# EAGLE design MRF49XA (EAGLE 6.6.0)
DATABASE: ../../partsDB.txt
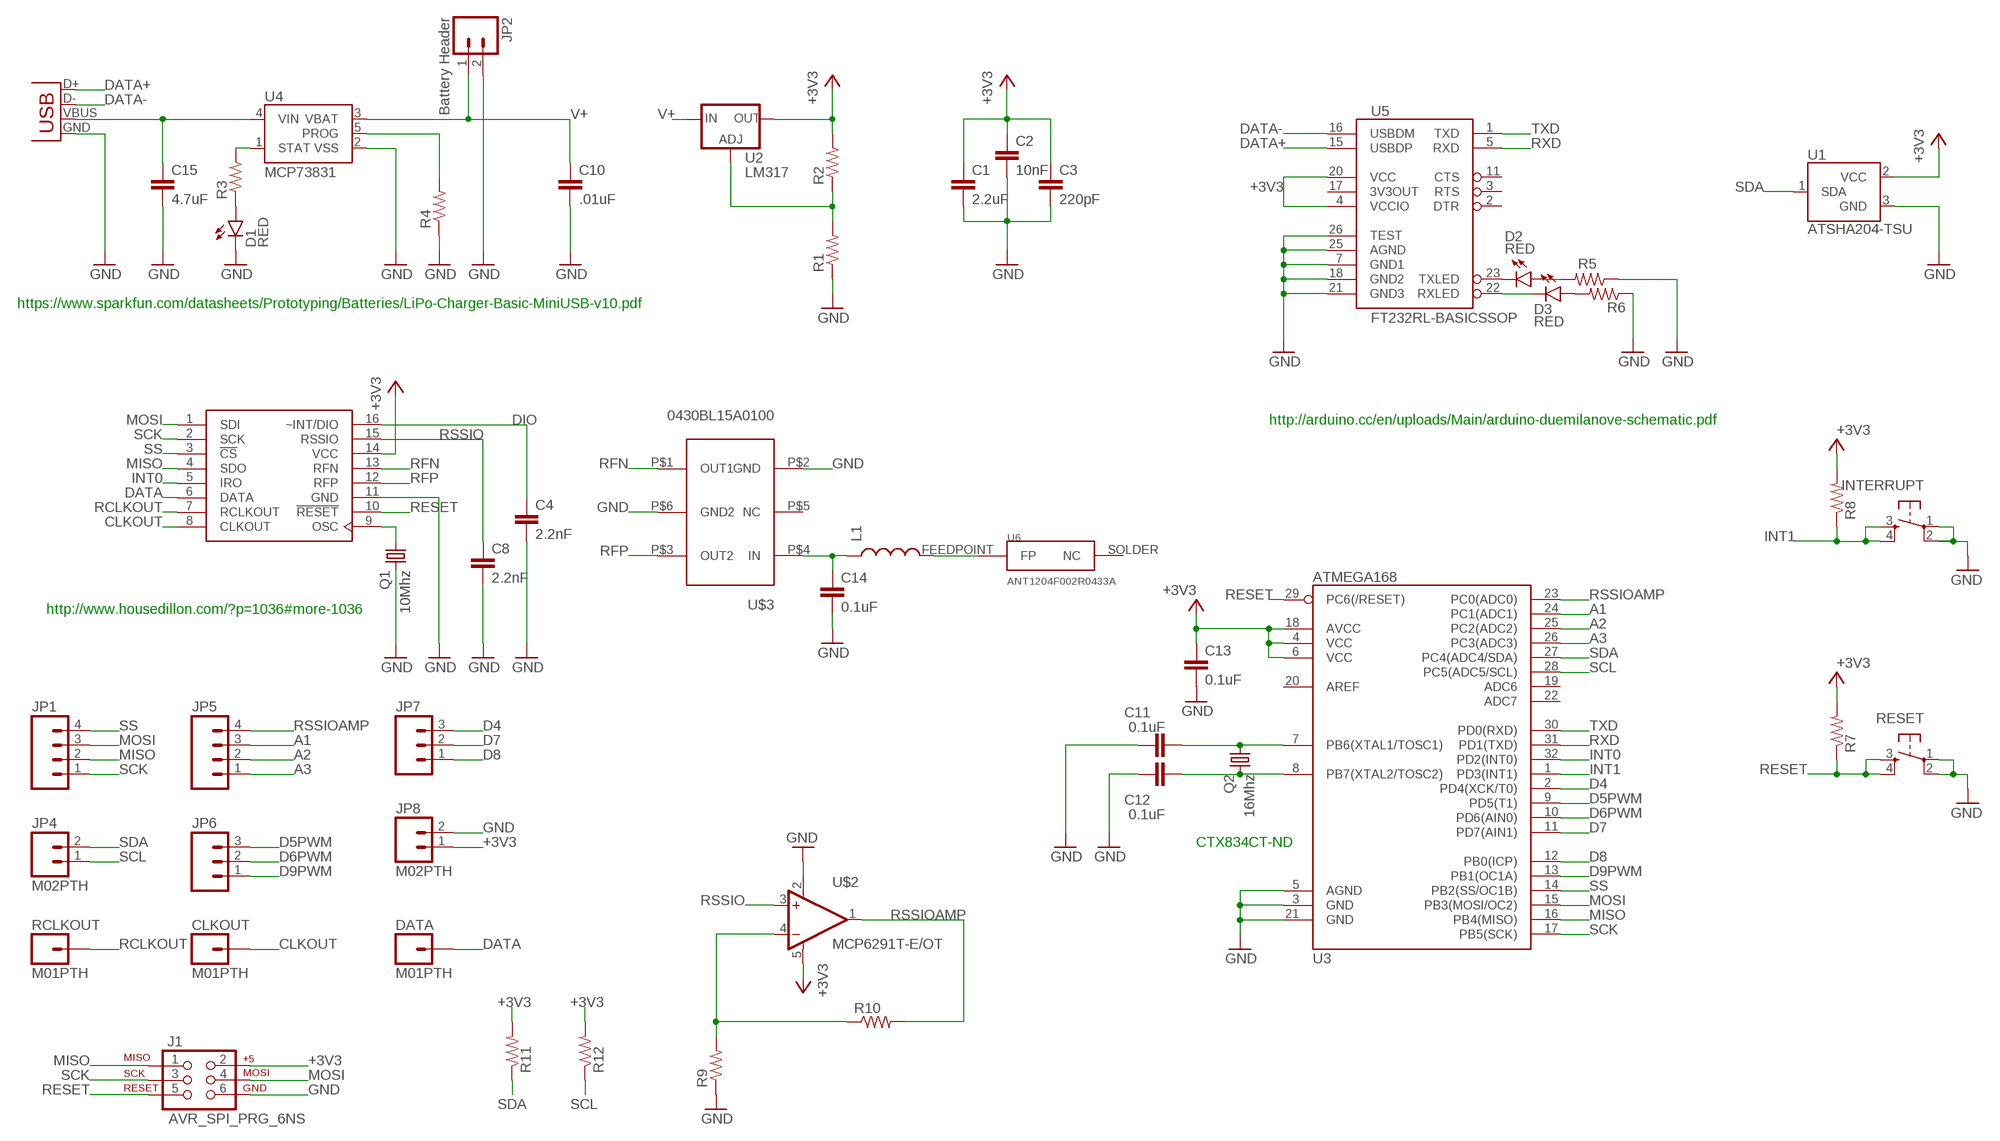
[diagram p0: schematic, sheet 1]

## Parts
C1  2.2uF  C-EUC3216  [C3216]
C2  10nF  C-EUC0603K  [C0603K]
C3  220pF  C-EUC0603  [C0603]
C4  2.2nF  C-EUC0603K  [C0603K]
C8  2.2nF  C-EUC0603K  [C0603K]
C10  .01uF  C-EUC3216  [C3216]
C11  0.1uF  0.1UF-25V-5%(0603)  [0603-CAP]
C12  0.1uF  0.1UF-25V-5%(0603)  [0603-CAP]
C13  0.1uF  0.1UF-25V-5%(0603)  [0603-CAP]
C14  0.1uF  0.1UF-25V-5%(0603)  [0603-CAP]
C15  4.7uF  C-EUC3216  [C3216]
CLKOUT  M01PTH  [1X01]
D1  RED  LED-RED0603  [LED-0603]
D2  RED  LED-RED0603  [LED-0603]
D3  RED  LED-RED0603  [LED-0603]
DATA  M01PTH  [1X01]
INTERRUPT  TAC_SWITCHSMD  [TACTILE-SWITCH-SMD]
J1  AVR_SPI_PRG_6NS  [2X3-NS]
JP1  M04PTH  [1X04]
JP2  Battery Header  M02LOCK_LONGPADS  [1X02_LOCK_LONGPADS]
JP3  USBSMD  [USB-MINIB]
JP4  M02PTH  [1X02]
JP5  M04PTH  [1X04]
JP6  M03PTH  [1X03]
JP7  M03PTH  [1X03]
JP8  M02PTH  [1X02]
L1  INDUCTOR0603  [0603]
Q1  10Mhz  CRYSTALCTS406  [CTS406]
Q2  16Mhz  CRYSTALCTS406  [CTS406]
R1  R-US_R0603  [R0603]
R2  R-US_R0603  [R0603]
R3  RESISTOR0603-RES  [0603-RES]
R4  RESISTOR0603-RES  [0603-RES]
R5  R-US_R0603  [R0603]
R6  R-US_R0603  [R0603]
R7  R-US_R0603  [R0603]
R8  R-US_R0603  [R0603]
R9  RESISTOR0603-RES  [0603-RES]
R10  RESISTOR0603-RES  [0603-RES]
R11  R-US_R0603  [R0603]
R12  R-US_R0603  [R0603]
RCLKOUT  M01PTH  [1X01]
RESET  TAC_SWITCHSMD  [TACTILE-SWITCH-SMD]
U1  ATSHA204-TSU  [SOT23-3]
U2  LM317  V_REG_317SMD  [SOT223]
U3  ATMEGA168  [TQFP32-08]
U4  MCP73831  [SOT23-5]
U5  FT232RL-BASICSSOP  [SSOP28DB]
U6  ANT1204F002R0433A  [ANT1204F002R0433A]
U$1  MRF49XA  [TSSOP16]
U$2  MCP6291T-E/OT  [SOT23-5]
U$3  0430BL15A0100  [0430BL15A0100]

## Nets
+3V3: C1.1 C2.1 C3.1 C13.1 J1.2 JP8.1 R2.2 R7.2 R8.2 R11.2 R12.2 U1.2(VCC) U2.2(OUT) U3.4(VCC) U3.6(VCC) U3.18(AVCC) U5.4(VCCIO) U5.20(VCC) U$1.14(VCC) U$2.5(V+)
A1: JP5.3 U3.24(PC1(ADC1))
A2: JP5.2 U3.25(PC2(ADC2))
A3: JP5.1 U3.26(PC3(ADC3))
CLKOUT: CLKOUT.1 U$1.8(CLKOUT)
D4: JP7.3 U3.2(PD4(XCK/T0))
D5PWM: JP6.3 U3.9(PD5(T1))
D6PWM: JP6.2 U3.10(PD6(AIN0))
D7: JP7.2 U3.11(PD7(AIN1))
D8: JP7.1 U3.12(PB0(ICP))
D9PWM: JP6.1 U3.13(PB1(OC1A))
DATA: DATA.1 U$1.6(DATA)
DATA+: JP3.D+ U5.15(USBDP)
DATA-: JP3.D- U5.16(USBDM)
DIO: C4.1 U$1.16(~INT/DIO)
GND: C1.2 C2.2 C3.2 C4.2 C8.2 C10.2 C11.1 C12.1 C13.2 C14.2 C15.2 D1.C INTERRUPT.1 INTERRUPT.2 J1.6 JP2.2 JP3.GND JP8.2 Q1.3 R1.1 R4.1 R5.1 R6.1 R9.1 RESET.1 RESET.2 U1.3(GND) U3.3(GND) U3.5(AGND) U3.21(GND) U4.2(VSS) U5.7(GND1) U5.18(GND2) U5.21(GND3) U5.25(AGND) U5.26(TEST) U$1.11(GND) U$2.2(V-) U$3.P$2(GND) U$3.P$6(GND2)
INT0: U3.32(PD2(INT0)) U$1.5(IRO)
INT1: INTERRUPT.3 INTERRUPT.4 R8.1 U3.1(PD3(INT1))
MISO: J1.1 JP1.2 U3.16(PB4(MISO)) U$1.4(SDO)
MOSI: J1.4 JP1.3 U3.15(PB3(MOSI/OC2)) U$1.1(SDI)
N$1: Q1.1 U$1.9(OSC)
N$2: L1.2 U6.FEEDPOINT(FP)
N$3: C15.1 JP3.VBUS U4.4(VIN)
N$5: R3.2 U4.1(STAT)
N$6: D1.A R3.1
N$8: R4.2 U4.5(PROG)
N$9: D2.C U5.23(TXLED)
N$10: D3.C U5.22(RXLED)
N$11: D2.A R5.2
N$12: D3.A R6.2
N$13: C11.2 Q2.1 U3.7(PB6(XTAL1/TOSC1))
N$14: C12.2 Q2.3 U3.8(PB7(XTAL2/TOSC2))
N$16: R9.2 R10.1 U$2.4(-IN)
N$19: R1.2 R2.1 U2.1(ADJ)
N$21: C14.1 L1.1 U$3.P$4(IN)
RCLKOUT: RCLKOUT.1 U$1.7(RCLKOUT)
RESET: J1.5 R7.1 RESET.3 RESET.4 U3.29(PC6(/RESET)) U$1.10(!RESET)
RFN: U$1.13(RFN) U$3.P$1(OUT1)
RFP: U$1.12(RFP) U$3.P$3(OUT2)
RSSIO: C8.1 U$1.15(RSSIO) U$2.3(+IN)
RSSIOAMP: JP5.4 R10.2 U3.23(PC0(ADC0)) U$2.1(OUT)
RXD: U3.31(PD1(TXD)) U5.5(RXD)
SCK: J1.3 JP1.1 U3.17(PB5(SCK)) U$1.2(SCK)
SCL: JP4.1 R12.1 U3.28(PC5(ADC5/SCL))
SDA: JP4.2 R11.1 U1.1(SDA) U3.27(PC4(ADC4/SDA))
SS: JP1.4 U3.14(PB2(SS/OC1B)) U$1.3(!CS)
TXD: U3.30(PD0(RXD)) U5.1(TXD)
V+: C10.1 JP2.1 U2.3(IN) U4.3(VBAT)
Unconnected: U3.19(ADC6) U3.20(AREF) U3.22(ADC7) U5.2(DTR) U5.3(RTS) U5.11(CTS) U5.17(3V3OUT) U6.SOLDER(NC) U$3.P$5(NC)

## Notes on the sheet
- https://www.sparkfun.com/datasheets/Prototyping/Batteries/LiPo-Charger-Basic-MiniUSB-v10.pdf
- http://arduino.cc/en/uploads/Main/arduino-duemilanove-schematic.pdf
- http://www.housedillon.com/?p=1036#more-1036
- CTX834CT-ND

## Power pins joined to a net without a drawn wire
VSS: U$1.P$1(VSS)

## Library data of the parts
C1-C4 C8 C10 C15 = rcl:C-EU: CAPACITOR, European symbol
C11-C14 = SparkFun-Capacitors:0.1UF-25V-5%(0603): CAP-08604; PROD_ID: CAP-08604
CLKOUT DATA RCLKOUT = SparkFun-Connectors:M01: Header 1 Standard 1-pin 0.1" header. Use with straight break away headers (SKU : PRT-00116), right angle break away headers (PRT-00553), swiss pins (PRT-00743), machine pins (PRT-00117), and female headers (PRT-00115).
D1-D3 = SparkFun-LED:LED-RED: Assorted Red LEDs LilyPad 1206- DIO-09912 1206- DIO-00809 0603- DIO-00819; PROD_ID: DIO-00819
INTERRUPT RESET = SparkFun-Electromechanical:TAC_SWITCH: Momentary Switch Button commonly used for reset or general input. Spark Fun Electronics SKU : COM-00097 SMT- SWCH-08247
J1 = SparkFun-Connectors:AVR_SPI_PRG_6: AVR ISP 6 Pin This is the reduced ISP connector for AVR programming. Common on Arduino. This footprint will take up less PCB space and can be used with a 10-pin to 6-pin adapter such as SKU: BOB-08508 **Special note about "TEST_POINT" package. The stop mask is on the top side, so if you want your programming test points to be on the bottom of your board, make sure to place this package on the bottom side of the board. This also ensure that the orientation to program from the bottom side will be correct.
JP1 JP5 = SparkFun-Connectors:M04: Header 4 Standard 4-pin 0.1" header. Use with straight break away headers (SKU : PRT-00116), right angle break away headers (PRT-00553), swiss pins (PRT-00743), machine pins (PRT-00117), and female headers (PRT-00115). Molex polarized connector foot print use with SKU : PRT-08231 with associated crimp pins and housings. 1MM SMD Version SKU: PRT-10208
JP2 JP4 JP8 = SparkFun-Connectors:M02: Standard 2-pin 0.1" header. Use with - straight break away headers ( PRT-00116) - right angle break away headers (PRT-00553) - swiss pins (PRT-00743) - machine pins (PRT-00117) - female headers (PRT-00115) Molex polarized connector foot print use with: PRT-08233 with associated crimp pins and housings. 2.54_SCREWTERM for use with PRT-10571. 3.5mm Screw Terminal footprints for PRT-08084 5mm Screw Terminal footprints for use with PRT-08433
JP3 = SparkFun-Connectors:USB: USB Connectors USB-B-PTH is fully proven SKU : PRT-00139/CONN-08278 USB-miniB is fully proven SKU : PRT-00587 USB-A-PCB is untested. USB-A-H is throughly reviewed, but untested. Spark Fun Electronics SKU : PRT-00437 USB-B-SMT is throughly reviewed, but untested. Needs silkscreen touching up. USB-A-S has not been used/tested USB-MB-H has not been used/tested USB-MICROB has been used. CONN-09505; PROD_ID: CONN-08193
JP6 JP7 = SparkFun-Connectors:M03: Header 3 Standard 3-pin 0.1" header. Use with straight break away headers (SKU : PRT-00116), right angle break away headers (PRT-00553), swiss pins (PRT-00743), machine pins (PRT-00117), and female headers (PRT-00115). Molex polarized connector foot print use with SKU : PRT-08232 with associated crimp pins and housings.
L1 = SparkFun-Passives:INDUCTOR: Inductors Basic Inductor/Choke - 0603 and 1206. Footprints are not proven and vary greatly between part numbers. SRN6045- 33uH, 20% 1.4A SDR0403-560KL - 56uH, 10%, 500mA RMS/740mA peak
Q1 Q2 = crystal:CRYSTAL: CRYSTAL; OC_FARNELL: unknown; OC_NEWARK: unknown
R1 R2 R5-R8 R11 R12 = rcl:R-US_: RESISTOR, American symbol
R3 R4 R9 R10 = SparkFun-Passives:RESISTOR: Resistor Basic schematic elements and footprints for 0603, 1206, and PTH resistors.
U1 = SparkFun-DigitalIC:ATSHA204: Atmel ATSHA204 The Atmel ATSHA204 is an optimized authentication chip that includes a 4.5Kb EEPROM. This array can be used for storage of keys, miscellaneous read/write, read-only, password or secret data, and consumption tracking. Access to the various sections of memory can be restricted in a variety of ways and then the configuration locked to prevent changes.
U2 = SparkFun:V_REG_317: Voltage Regulator Standard LM317 adjustable voltage regulator. AOI (Adjust Output Input). Google 'LM317 Calculator' for easy to use app to get the two resistor values needed. 240/720 for 5V output. 240/390 for 3.3V output. Spark Fun Electronics SKU : COM-00527
U3 = SparkFun-DigitalIC:ATMEGA168: Atmel 32-pin 8-bit micro, 16k flash.
U4 = SparkFun-PowerIC:MCP73831: Miniature single cell, fully integrated Li-Ion, Li-polymer charge management controller http://ww1.microchip.com/downloads/en/DeviceDoc/21984a.pdf IC-09995; PROD_ID: IC-09995
U5 = SparkFun-DigitalIC:FT232RL-BASIC: USB UART This is the simplified version of the FT232RL unit. Only what you need, nothing you don't. Spark Fun Electronics SKU : COM-00650
U6 = TestLibrary:ANT1204F002R0433A: ANT1204F002R0433A http://www.yageo.com/documents/recent/An_SMD_UHF_433_1204_0.pdf
U$1 = microchip:MRF49XA
U$2 = SparkFun-AnalogIC:MCP6291: Rail to rail OpAmp with 10MHz GBP; PROD_ID: IC-11991
U$3 = TestLibrary:0430BL15A0100: 430Mhz Balun from Johanson Technologies

## Board
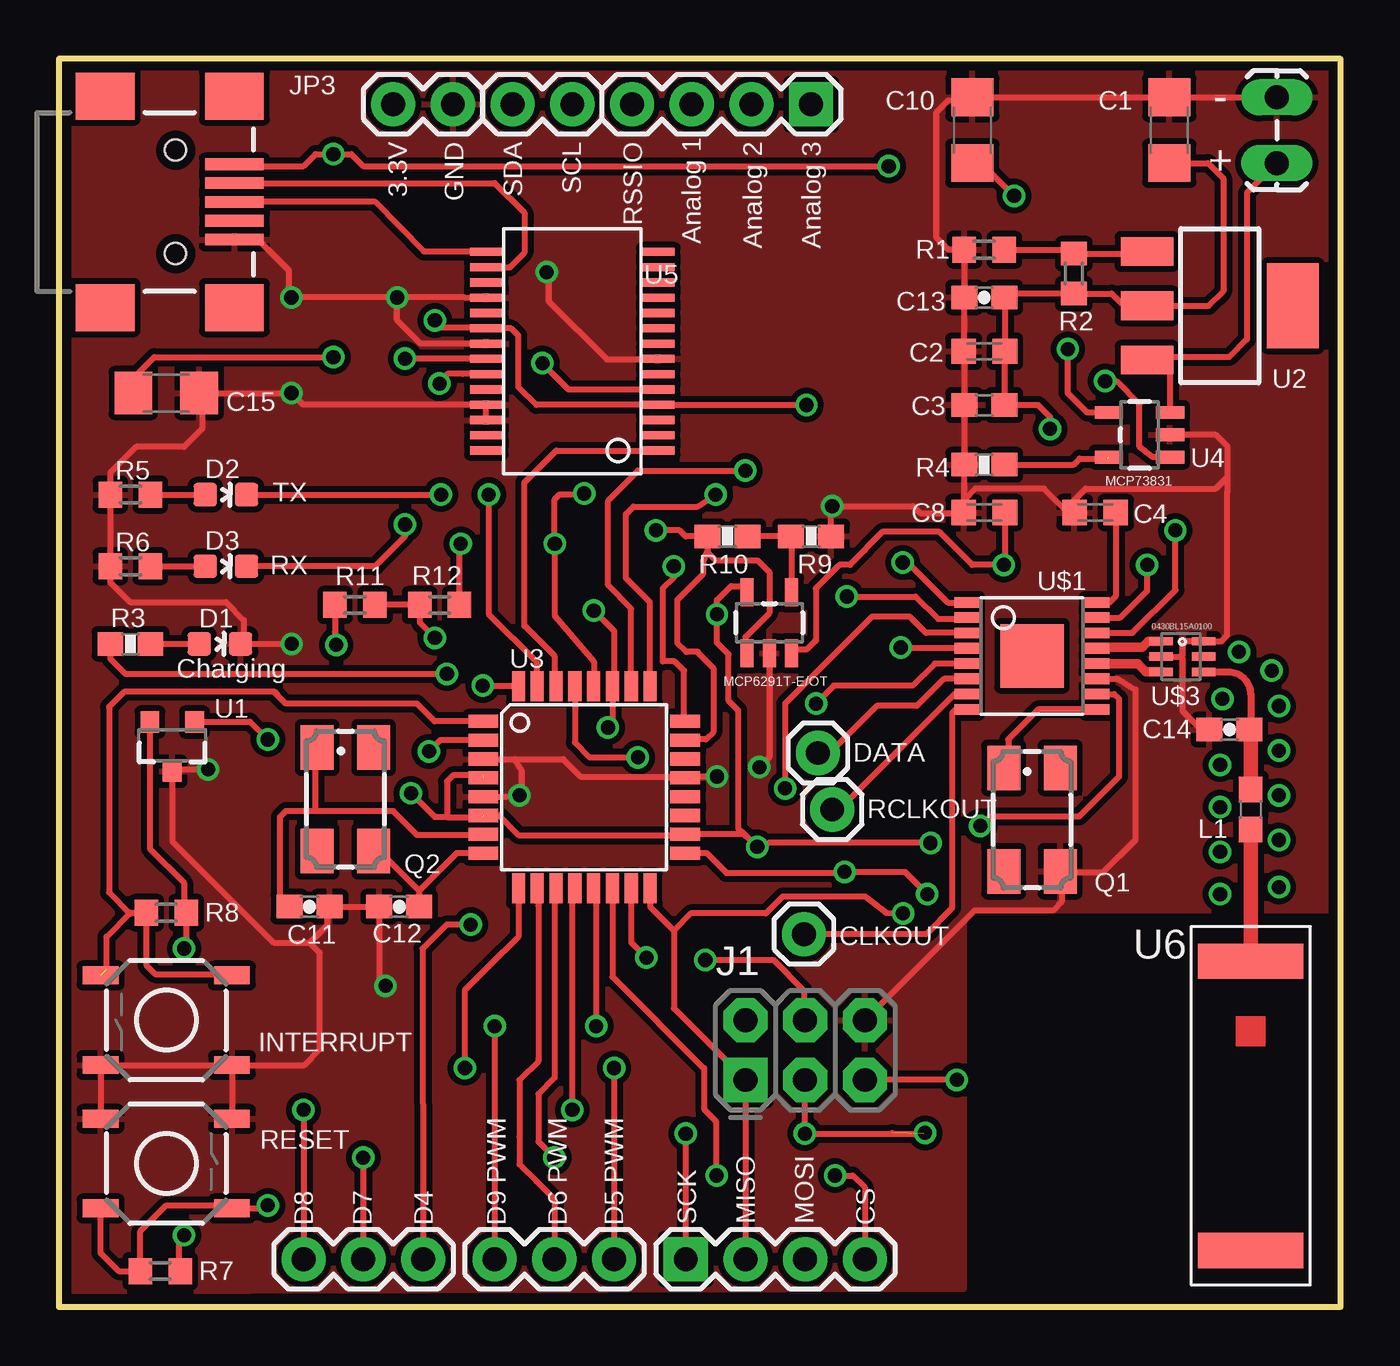
[diagram p1: board, top side]
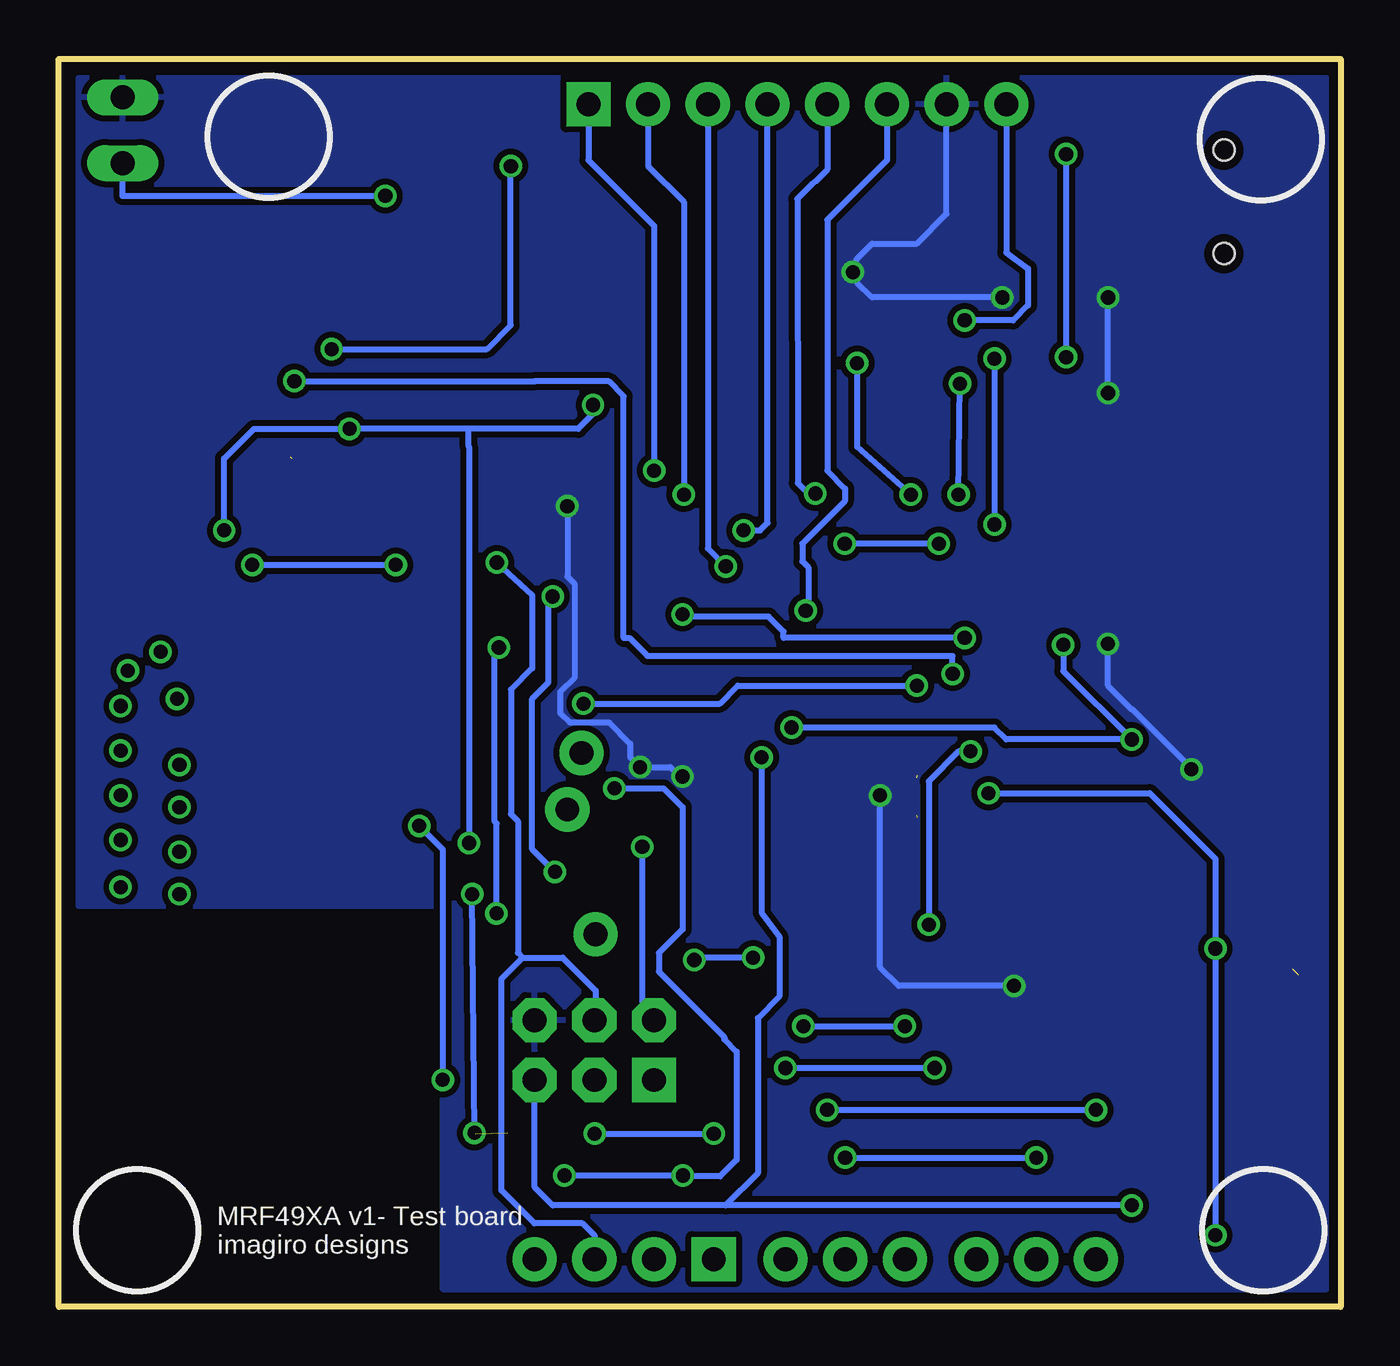
[diagram p2: board, bottom side, seen from below]

Size 54.53 x 53.08 mm. Coordinates in mm from the lower left corner, seen from the top.
Outline: 0,0 54.53,0 54.53,53.08 0,53.08 0,0
Copper layers (1*16): Top 0.0356mm / dielectric 1.5011mm / Bottom 0.0356mm
Design rules "LaenPCBOrder": minimum track width 6mil, minimum drill 13mil, track to track 6mil, track to pad 6mil, pad to pad 6mil, via to via 6mil, smd to smd 6mil, copper to edge 15mil, drill to drill 6mil, minimum pad ring 7mil, minimum via ring 7mil, stop-mask expansion 3mil, vias tented up to drill 0mil, thermal gap 10mil

### Footprints (pad centres in the part's own frame; a part is rotated, then mirrored left to right if it is on the bottom)
C3216 = smd 1.6 x 1.8: 1 -1.4,0; 2 1.4,0
C0603K = smd 1.05 x 1.08: 1 -0.875,0; 2 0.875,0
C0603 = smd 1.1 x 1: 1 -0.85,0; 2 0.85,0
0603-CAP = smd 1.1 x 1: 1 -0.85,0; 2 0.85,0
1X01 = drill 1.016 pad 1.88: 1 0,0
LED-0603 = smd 1 x 1: A 0,-0.877; C 0,0.877
TACTILE-SWITCH-SMD = smd 1.524 x 0.762: 1 -2.794,1.905; 2 2.794,1.905; 3 -2.794,-1.905; 4 2.794,-1.905
2X3-NS = drill 1.016 pad 1.88 square: 1 -2.54,-1.27 | drill 1.016 pad 1.88 octagon: 2 -2.54,1.27; 3 0,-1.27; 4 0,1.27; 5 2.54,-1.27; 6 2.54,1.27
1X04 = drill 1.016 pad 1.88 square: 1 0,0 | drill 1.016 pad 1.88: 2 2.54,0; 3 5.08,0; 4 7.62,0
1X02_LOCK_LONGPADS = drill 1.016 long: 1 -0.127,0; 2 2.667,0
USB-MINIB = smd 2.5 x 0.5: D+ 2.5,0; D- 2.5,0.8; GND 2.5,-1.6; ID 2.5,-0.8; VBUS 2.5,1.6 | smd 2.5 x 2: MTN1 -3,4.5; MTN2 2.5,4.5; MTN3 -3,-4.5; MTN4 2.5,-4.5 | hole 0.9: 0,2.2; 0,-2.2
1X02 = drill 1.016 pad 1.88: 1 0,0; 2 2.54,0
1X03 = drill 1.016 pad 1.88: 1 0,0; 2 2.54,0; 3 5.08,0
0603 = smd 1.1 x 1: 1 -0.85,0; 2 0.85,0
CTS406 = smd 1.9 x 1.4: 1 -2.2,-1.2; 2 2.2,-1.2; 3 2.2,1.2; 4 -2.2,1.2
R0603 = smd 1 x 1.1: 1 -0.85,0; 2 0.85,0
0603-RES = smd 1.1 x 1: 1 -0.85,0; 2 0.85,0
SOT23-3 = smd 0.8 x 0.9: 1 -0.95,-1; 2 0.95,-1; 3 0,1.1
SOT223 = smd 1.219 x 2.235: 1 -2.311,-3.099; 2 0,-3.099; 3 2.311,-3.099 | smd 3.6 x 2.2: 4 0,3.099
TQFP32-08 = smd 1.27 x 0.559: 1 -4.293,2.8; 2 -4.293,2; 3 -4.293,1.2; 4 -4.293,0.4; 5 -4.293,-0.4; 6 -4.293,-1.2; 7 -4.293,-2; 8 -4.293,-2.8; 17 4.293,-2.8; 18 4.293,-2; 19 4.293,-1.2; 20 4.293,-0.4; 21 4.293,0.4; 22 4.293,1.2; 23 4.293,2; 24 4.293,2.8 | smd 0.559 x 1.27: 9 -2.8,-4.293; 10 -2,-4.293; 11 -1.2,-4.293; 12 -0.4,-4.293; 13 0.4,-4.293; 14 1.2,-4.293; 15 2,-4.293; 16 2.8,-4.293; 25 2.8,4.293; 26 2,4.293; 27 1.2,4.293; 28 0.4,4.293; 29 -0.4,4.293; 30 -1.2,4.293; 31 -2,4.293; 32 -2.8,4.293
SOT23-5 = smd 0.55 x 1.2: 1 -0.95,-1.3; 2 0,-1.3; 3 0.95,-1.3; 4 0.95,1.3; 5 -0.95,1.3
SSOP28DB = smd 0.348 x 1.397: 1 -4.225,-3.656; 2 -3.575,-3.656; 3 -2.925,-3.656; 4 -2.275,-3.656; 5 -1.625,-3.656; 6 -0.975,-3.656; 7 -0.325,-3.656; 8 0.325,-3.656; 9 0.975,-3.656; 10 1.625,-3.656; 11 2.275,-3.656; 12 2.925,-3.656; 13 3.575,-3.656; 14 4.225,-3.656; 15 4.225,3.656; 16 3.575,3.656; 17 2.925,3.656; 18 2.275,3.656; 19 1.625,3.656; 20 0.975,3.656; 21 0.325,3.656; 22 -0.325,3.656; 23 -0.975,3.656; 24 -1.625,3.656; 25 -2.275,3.656; 26 -2.925,3.656; 27 -3.575,3.656; 28 -4.225,3.656
ANT1204F002R0433A = smd 1.5 x 4.5: FEEDPOINT -6.15,0; SOLDER 6.15,0
TSSOP16 = smd 0.45 x 1.05: 1 -2.275,-2.768; 2 -1.625,-2.768; 3 -0.975,-2.768; 4 -0.325,-2.768; 5 0.325,-2.768; 6 0.975,-2.768; 7 1.625,-2.768; 8 2.275,-2.768; 9 2.275,2.768; 10 1.625,2.768; 11 0.975,2.768; 12 0.325,2.768; 13 -0.325,2.768; 14 -0.975,2.768; 15 -1.625,2.768; 16 -2.275,2.768 | smd 2.7 x 2.7: P$1 0,0
0430BL15A0100 = smd 0.35 x 1: P$1 0.65,0.9; P$2 0,0.9; P$3 -0.65,0.9; P$4 -0.65,-0.9; P$5 0,-0.9; P$6 0.65,-0.9

### Placement (x,y rotation side)
C1  47.24,50.04 90 top
C2  39.37,40.64 180 top
C3  39.37,38.35 180 top
C4  44.09,33.78 180 top
C8  39.37,33.78 180 top
C10  38.86,50.04 90 top
C11  10.67,17.02 180 top
C12  14.48,17.02 0 top
C13  39.37,42.93 180 top
C14  49.8,24.55 180 top
C15  4.57,38.86 0 top
CLKOUT  31.7,15.85 0 top
D1  6.86,28.19 270 top
D2  7.11,34.54 270 top
D3  7.11,31.5 270 top
DATA  32.3,23.55 0 top
INTERRUPT  4.57,12.19 180 top
J1  31.75,10.92 0 top
JP1  26.67,2.03 0 top
JP2  51.82,48.77 90 top
JP3  4.97,46.99 0 top
JP4  21.84,51.15 180 top
JP5  32,51.15 180 top
JP6  18.54,2.03 0 top
JP7  10.41,2.03 0 top
JP8  14.22,51.15 0 top
L1  50.7,21.15 270 top
Q1  41.4,20.72 270 top
Q2  12.19,21.59 270 top
R1  39.37,44.96 0 top
R2  43.18,43.94 270 top
R3  3.05,28.19 180 top
R4  39.37,35.81 0 top
R5  3.05,34.54 0 top
R6  3.05,31.5 0 top
R7  4.32,1.52 0 top
R8  4.57,16.76 0 top
R9  32,32.77 180 top
R10  28.45,32.77 180 top
R11  12.6,29.85 0 top
R12  16.2,29.85 180 top
RCLKOUT  32.9,21.15 0 top
RESET  4.57,6.1 0 top
U1  4.83,23.88 180 top
U2  49.39,42.57 270 top
U3  22.35,22.1 0 top
U4  45.97,37.08 90 top
U5  21.84,40.64 90 top
U6  50.7,8.55 270 top
U$1  41.4,27.69 270 top
U$2  30.23,29.09 0 top
U$3  47.8,27.65 90 top

### Tracks (layer width: path | path; a pad name or v marks a point on that pad's centre or on a via)
+3V3  (via drill 0.6)  (2 unrouted)
  Top 0.254: C1.1 48.9,48.64 49.53,48.01 49.53,43.18 48.92,42.57 U2.2 45.21,42.67 44.79,43.09 R2.2 40.39,43.09 C13.1 40.24,42.9 C2.1 40.24,38.38 C3.1 41.66,38.35 42.16,37.85 v42.16,37.34 | v31.81,38.35 25.65,38.35 U5.4 25.4,38.35 20.32,38.35 19.56,39.12 19.56,41.3 19.24,41.62 18.23,41.62 U5.20 18.15,41.65 16.3,41.65 v16,41.95 | 16.51,20.83 16.51,22.35 16.76,22.61 18.03,22.61 | 16.51,20.83 18.03,20.83 | U1.2 3.88,19.49 5.33,18.03 5.33,16.85 R8.2 5.42,15.07 v5.33,15.24 | 29.18,20.1 v29.71,19.57 | v5.33,3.05 5.1,2.75 5.1,1.96 5.08,1.94 R7.2 | 16.51,20.83 16,20.83 v14.99,21.84 | v37.08,19.73 30.2,19.73 30.04,19.57 v29.71,19.57 | U$1.14 45.68,28.66 47.5,30.48 v47.5,33.02 | U3.6 18.73,20.9 19.56,20.07 26.61,20.07 U3.18 29.18,20.1 | R11.2 R12.2 15.35,29.1 v16,28.45 | 29.21,20.03 v29.71,19.57 | U$2.5 29.02,30.65 28.6,30.65 28,30.05 v28,29.45 28,28.25 28.5,27.75 28.5,25.77 28.9,25.37 28.9,20.35 29.18,20.1
  Bottom 0.254: J1.2 29.7,12.95 v29.7,19.56 v29.71,19.57 | v5.33,3.05 v5.33,15.24 5.33,19.05 8.13,21.84 v14.99,21.84 | v31.81,38.35 v31.8,38.35 31.8,37.97 32.44,37.34 37.1,37.34 | 37.1,37.34 v42.16,37.34 46.23,37.34 47.5,36.07 v47.5,33.02 | v37.08,19.73 37.08,36.58 37.1,36.59 37.1,37.34 | v16,28.45 23.7,28.45 23.7,28.72 24.34,29.35 27.9,29.35 v28,29.45 | JP8.1 14.22,44.83 13.3,44.15 13.3,42.59 13.94,41.95 v16,41.95
A1  (via drill 0.6)
  Top 0.254: U3.24 26.6,24.85 26.6,27.05 26.2,27.45 25.7,27.45 25.7,30.55 26.16,31.02 v26.16,31.5
  Bottom 0.254: JP5.3 26.92,32.26 v26.16,31.5
A2  (via drill 0.6)
  Top 0.254: U3.25 25.15,29.97 24.13,30.99 24.13,33.72 24.45,34.04 27.18,34.04 v27.94,34.54
  Bottom 0.254: JP5.2 29.46,48.51 27.94,46.99 v27.94,34.54
A3  (via drill 0.6)
  Top 0.254: U3.26 24.35,29.69 24.34,29.69 23.37,30.69 23.37,34.29 24.64,35.56 v29.21,35.56
  Bottom 0.254: JP5.1 32,48.77 29.21,45.97 v29.21,35.56
CLKOUT
  Top 0.254: U$1.8 38.16,25.41 38,25.25 38,16.95 36.9,15.85 CLKOUT.1
D4  (via drill 0.6)
  Top 0.254: U3.2 16.22,24.1 v15.75,23.62 | v17.53,16.26 16.51,16.26 16.49,16.25 15.47,15.23 JP7.3
  Bottom 0.254: v15.75,23.62 16.26,23.62 17.53,22.35 v17.53,16.26
D5PWM  (via drill 0.6)
  Top 0.254: U3.9 19.56,15.75 18.29,14.48 17.78,13.97 17.27,13.46 v17.27,10.16 | v23.62,10.16 JP6.3
  Bottom 0.254: v17.27,10.16 v23.62,10.16
D6PWM
  Top 0.254: U3.10 20.32,17.77 20.4,17.05 20.4,10.55 20.4,10.45 19.6,9.65 19.6,7.25 19.6,6.05 20.32,5.33 21.08,4.57 JP6.2
D7  (via drill 0.6)
  Top 0.254: U3.11 21.08,17.74 21.1,17.05 21.1,9.75 20.4,9.05 20.4,7.03 v21.08,6.35 | v12.95,6.35 JP7.2
  Bottom 0.254: v21.08,6.35 v12.95,6.35
D8  (via drill 0.6)
  Top 0.254: U3.12 21.84,17.7 v21.84,8.38 | v10.41,8.38 JP7.1
  Bottom 0.254: v21.84,8.38 v10.41,8.38
D9PWM  (via drill 0.6)
  Top 0.254: U3.13 22.86,17.7 v22.86,11.94 | v18.54,11.94 JP6.1
  Bottom 0.254: v22.86,11.94 v18.54,11.94
DATA
  Top 0.254: U$1.6 37.66,26.71 36.5,25.55 34.8,25.55 33,23.75 33,23.55 DATA.1
DATA+
  Top 0.254: U5.15 18.09,44.88 15.54,44.88 13.46,46.99 7.11,46.99 JP3.D+
DATA-
  Top 0.254: JP3.D- 18.54,47.79 19.81,46.52 19.81,44.83 19.18,44.2 18.21,44.2 U5.16
DIO
  Top 0.254: C4.1 44.96,30.22 44.7,29.95 U$1.16
GND  (via drill 0.6)
  Top 0.254: JP2.2 53.08,51.44 C1.2 C10.2 38.73,51.31 37.85,51.31 37.34,50.8 37.34,45.47 37.85,44.96 R1.1 C13.2 38.49,42.9 C2.2 38.52,40.61 C3.2 R4.1 38.49,35.79 38.49,34.29 | 38.49,34.29 C8.2 38.47,33.75 36.65,33.75 36.35,34.05 v32.9,34.05 | JP3.GND 7.11,45.47 8.4,45.47 9.4,44.47 9.8,44.05 9.8,43.02 v9.9,42.93 v14.39,42.93 | v14.39,42.93 17.27,42.93 U5.18 | U5.26 U5.25 10.39,38.36 v9.9,38.86 C15.2 6.1,38.74 6.1,37.34 5.33,36.58 3.3,36.58 2.2,35.47 R5.1 R6.1 2.2,30.82 3.05,29.97 7.11,29.97 7.87,29.21 7.87,28.33 D1.C v9.91,28.19 | U5.21 17.2,40.96 17.04,40.97 15.39,40.97 14.39,41.97 v14.39,42.93 | v20.75,44 20.84,43.92 20.84,42.77 23.32,40.29 25.48,40.29 U5.7 | 10.67,15.49 9.14,15.49 4.83,19.81 U1.3 4.91,22.86 v6.35,22.86 | 10.67,15.49 11.43,16.26 11.43,16.93 C11.1 C12.1 13.63,13.93 v13.9,13.65 | 49.72,35.31 49.21,34.8 43.69,34.8 42.81,33.92 C4.2 42.81,33.89 41.91,34.8 39,34.8 38.49,34.29 | 49.72,35.31 49.72,36.58 49.21,37.08 U4.2 | 42.6,19.27 Q1.3 42.67,18.45 | U$3.P$2 47.7,27.65 | 47.7,27.65 47.8,27.55 47.8,25.35 48.6,24.55 C14.2 | 49.72,35.31 49.72,34.68 49.7,34.65 49.7,28.55 49.45,28.3 U$3.P$6 47.95,28.3 47.8,28.15 47.8,27.75 47.7,27.65 | U$1.11 45.04,26.71 45.8,26.25 45.8,19.85 44.4,18.45 42.67,18.45 | 42.67,18.45 42.67,17.23 42.3,16.85 38.95,16.85 J1.6 | RESET.1 INTERRUPT.2 INTERRUPT.1 | INTERRUPT.1 RESET.2 | R9.1 32.8,32.82 | U$2.2 30.23,23.38 v29.8,22.95 | v28,22.55 26.7,22.55 U3.21 26.59,22.55 22.2,22.55 21.46,23.3 19.4,23.3 | R9.1 32.85,33.75 v32.9,34.05 | R9.1 32.85,33.71 v32.9,34.05 | U3.3 19.4,23.3 | U3.5 19.04,21.7 19.7,21.75 | 19.7,21.75 19.7,22.8 19.4,23.3
  Top 0.254: INTERRUPT.1 10.43,10.29 11.1,10.95 11.1,15.06 10.67,15.49 | 19.7,21.75 19.8,21.85 v19.6,21.75
  Bottom 0.254: JP8.2 16.76,46.48 18.03,45.21 19.94,45.21 20.57,44.58 v20.75,44 20.57,43.56 19.94,42.93 v14.39,42.93 | v9.9,38.86 v9.9,42.93 | v6.35,22.86 6.35,22.9 8.85,25.4 8.89,25.4 9.91,26.42 v9.91,28.19 | v28,22.55 28.2,22.55 28.2,22.64 28.52,22.95 v29.8,22.95 30.23,23.38 30.23,23.95 31.13,24.85 32.8,24.85 33.2,25.25 33.2,26.15 32.6,26.75 32.6,30.75 32.9,31.05 v32.9,34.05 | v13.9,13.65 18.8,13.65 19.6,14.45 v19.6,21.75
  pour Top (isolate 0.254): 0.8,52.55 54,52.55 54,16.85 38.5,16.85 38.5,0.75 0.6,0.65 0.6,52.65 0.9,52.65
  pour Bottom (isolate 0.254): 0.6,52.25 53.7,52.25 53.7,17.05 38.2,17.05 38.2,0.75 0.6,0.75
INT0  (via drill 0.6)
  Top 0.254: U$1.5 37.27,27.36 36.32,26.42 32.97,26.42 v32.21,25.65 | U3.32 18.06,26.39 v18.03,26.42
  Bottom 0.254: v32.21,25.65 26.42,25.65 25.65,26.42 v18.03,26.42
INT1  (1 unrouted)
  Top 0.254: 2.03,14.35 2.03,15.75 3.05,16.76 | 3.05,16.76 R8.1 3.72,14.53 4.1,14.15 7.31,14.15 INTERRUPT.3 | U3.1 16,24.9 15.24,25.65 9.65,25.65 9.14,26.16 9.35,25.96 9.2,26.15 2.77,26.15 2.14,25.52 2.14,17.63 3.05,16.72 3.05,16.76
MISO  (via drill 0.6)
  Top 0.254: JP1.2 J1.1 26.16,12.7 26.16,16 | 38.61,28.04 U$1.4 | v35.91,16.73 35.2,16.75 34.3,17.45 30.8,17.45 30.08,16.73 26.89,16.73 26.16,16 | U3.16 25.15,17.01 26.16,16 | 38.59,28.05 U$1.4 | v35.81,28.04 38.6,28.04 U$1.4
  Bottom 0.254: v35.91,16.73 35.9,16.95 35.9,20.55 36,20.65 36,27.85 v35.81,28.04
MOSI  (via drill 0.6)
  Top 0.254: U3.15 24.35,15.5 v25,14.85 | v27.5,14.75 30.4,14.75 31.7,13.45 31.7,12.24 J1.4 | v35.9,31.65 36.13,31.65 37.83,29.95 U$1.1
  Bottom 0.254: JP1.3 31.75,3.05 32.25,3.56 34.3,3.56 35.7,4.95 35.7,13.95 34.8,14.85 | v25,14.85 27.4,14.85 v27.5,14.75 | 34.8,14.85 33.1,14.85 31.7,13.45 31.7,12.24 J1.4 | v35.9,31.65 34.4,30.25 34.4,27.15 35.3,26.25 35.3,20.95 35,20.65 35,15.05 34.8,14.85
N$1
  Top 0.254: U$1.9 41.67,25.41 40.39,24.13 40.39,23.11 Q1.1
N$2
  Top 0.61: L1.2 U6.FEEDPOINT
N$3  (via drill 0.6)
  Top 0.254: C15.1 3.17,39.49 4.06,40.39 v11.68,40.39 | 6.86,48.51 10.41,48.51 10.92,49.02 v11.68,49.02 12.45,49.02 12.95,48.51 v35.31,48.51 | 6.86,48.51 6.6,48.51 | 6.86,48.51 JP3.VBUS | U4.4 43.75,38.03 42.93,38.86 v42.93,40.73
  Bottom 0.254: v11.68,49.02 v11.68,40.39 | v42.93,40.73 36.32,40.73 35.31,41.75 v35.31,48.51
N$4  (via drill 0.6)
  other vias: 50.2,27.85
N$5  (via drill 0.6)
  Top 0.254: R3.2 2.2,27.56 2.83,26.92 v16.51,26.92 | U4.1 46.55,36.13 45.97,36.58 45.97,38.38 45,39.35 v44.51,39.37
  Bottom 0.254: v16.51,26.92 16.51,27.69 29.5,27.69 30.26,28.45 30.5,28.45 30.5,38.72 31.14,39.35 34.27,39.35 34.29,39.37 v44.51,39.37
N$6
  Top 0.254: R3.1 D1.A
N$7  (via drill 0.6)
  other vias: 51.6,27.05
N$8  (1 unrouted)
  Top 0.254: R4.2 43.18,35.81 43.43,36.07 44.61,36.07
N$9  (via drill 0.6)
  Top 0.254: D2.C v16.26,34.54 | v16.2,39.26 16.2,39.33 16.54,39.67 17.18,39.67 18.23,39.68 U5.23
  Bottom 0.254: v16.26,34.54 v16.2,39.26
N$10  (via drill 0.6)
  Top 0.254: v14.73,33.27 14.73,32.77 13.46,31.5 D3.C | v14.73,40.33 18.29,40.33 U5.22
  Bottom 0.254: v14.73,40.33 v14.73,33.27
N$11
  Top 0.254: R5.2 D2.A
N$12
  Top 0.254: R6.2 D3.A
N$13
  Top 0.254: Q2.1 10.92,22.86 10.92,21.08 | 10.92,21.08 9.65,21.08 9.4,20.83 9.4,17.02 C11.2 | U3.7 18.03,20.07 15.24,20.07 14.22,21.08 10.92,21.08
N$14
  Top 0.254: U3.8 16.92,19.3 15.32,17.69 | 15.32,17.69 15.32,17.03 C12.2 | Q2.3 13.62,19.39 15.32,17.69
N$15  (via drill 0.6)
  other vias: 51.9,25.55
N$16
  Top 0.254: R10.1 R9.2 31.18,32.74 U$2.4
N$17  (via drill 0.6)
  other vias: 51.9,23.65
N$18  (via drill 0.6)
  other vias: 51.9,21.75
N$19
  Top 0.254: R1.2 43.01,44.96 R2.1 47,44.79 U2.1
N$20  (via drill 0.6)
  other vias: 51.9,19.85
N$21
  Top 0.254: 50.7,24.6 arc-90 C14.1
  Top 0.305: U$3.P$4 49.75,27 arc-90 50.7,26.05 50.7,24.6
  Top 0.406: C14.1 arc-90 50.7,24.5
  Top 0.61: 50.7,24.5 L1.1
N$22  (via drill 0.6)
  other vias: 51.9,17.85
N$23  (via drill 0.6)
  other vias: 49.4,19.35
N$24  (via drill 0.6)
  other vias: 49.4,17.55
N$25  (via drill 0.6)
  other vias: 49.4,21.25
N$26  (via drill 0.6)
  other vias: 49.5,25.85
N$27  (via drill 0.6)
  other vias: 49.4,23.05
RCLKOUT
  Top 0.254: U$1.7 38.11,26.06 33.5,21.45 33.2,21.45 RCLKOUT.1
RESET  (via drill 0.6)
  Top 0.254: v8.89,4.32 8.76,4.19 RESET.4 7.24,4.32 4.57,4.32 3.47,3.21 R7.1 2.54,1.52 1.78,2.29 RESET.3 | U3.29 21.95,24 22.59,23.37 v24.64,23.37 | U$1.10 44.89,26.06 45.1,25.85 45.1,22.55 43.4,20.85 39.6,20.85 v39.2,20.45 | v38.2,9.65 J1.5
  Bottom 0.254: v8.89,4.32 26.16,4.32 | 26.16,4.32 33.53,4.32 34.29,5.08 J1.5 | v24.64,23.37 24.64,16.76 23.88,15.75 23.88,13.21 24.8,12.28 24.8,5.68 26.16,4.32 | v39.2,20.45 38.2,19.45 v38.2,9.65
RFN
  Top 0.406: U$3.P$1 46.35,28.3 46.1,28.05 44.21,28.05 U$1.13
RFP
  Top 0.406: U$3.P$3 46.25,27 45.9,27.35 U$1.12
RSSIO  (via drill 0.6)
  Top 0.254: C8.1 40.24,31.55 v40.2,31.55 38.87,31.55 37.47,32.95 35.03,32.95 34.4,32.32 34.3,32.19 33.66,31.55 33.2,31.55 32.2,30.55 32.2,28.32 32.16,28.32 31.8,27.95 31.34,27.95 U$2.3 31.2,27.65 | U$1.15 45.16,29.31 46.3,30.45 v46.3,31.55
  Bottom 0.254: v46.3,31.55 v40.2,31.55
RSSIOAMP  (via drill 0.6)
  Top 0.254: v25.4,33.02 26.42,33.02 26.67,32.77 R10.2 27.6,32.17 | 27.6,32.17 27.6,32.09 27.94,31.75 29.72,31.75 30.23,31.24 30.23,29.5 29.21,28.49 29.21,27.86 U$2.1 | 27.6,32.17 27.43,31.75 27.4,31.72 27.4,31.15 26.3,30.05 26.3,28.25 26.7,27.85 27.2,27.85 27.2,27.81 27.85,27.17 27.85,24.45 27.53,24.13 26.68,24.13 U3.23
  Bottom 0.254: v25.4,33.02 24.7,33.02 24.38,33.34 JP5.4
RXD  (via drill 0.6)
  Top 0.254: U5.5 21.67,39.02 20.57,40.12 v20.57,40.13 | v18.29,34.54 18.29,29.46 20.32,27.43 U3.31
  Bottom 0.254: v18.29,34.54 20.57,36.58 v20.57,40.13
SCK  (via drill 0.6)  (1 unrouted)
  Top 0.254: U3.17 26.67,19.3 27.55,19.3 28.4,18.45 33.48,18.45 v33.43,18.5 36,18.5 v36.95,17.55 | 38.53,29.31 U$1.2 38.58,29.25 37.4,29.25 36.44,30.21 v33.53,30.21 | v26.67,7.37 JP1.1 | J1.3 31.74,9.61 v31.74,7.37 36.81,7.37 v36.85,7.4 | 35.41,7.37 35.45,7.4
  Bottom 0.254: v33.43,18.5 33.4,18.45 34.4,19.45 34.4,25.85 33.7,26.55 33.7,30.04 v33.53,30.21 | v31.74,7.37 v26.67,7.37 | v36.85,7.4 v36.95,17.55
SCL  (via drill 0.6)
  Top 0.254: U3.28 22.76,27.43 21.12,29.37 21.1,29.39 v21.1,32.45 21.1,34.35 21.3,34.55 22.32,34.55 v22.35,34.59 | R12.1 17.05,32.4 v17.1,32.45
  Bottom 0.254: JP4.1 21.84,48.36 22.35,47.85 22.48,47.75 23.11,47.12 23.09,35.03 22.84,34.77 22.86,34.8 v22.35,34.59 | v17.1,32.45 v21.1,32.45
SDA  (via drill 0.6)
  Top 0.254: U1.1 5.79,24.89 8.13,24.89 v8.89,24.13 | v23.36,24.64 23.55,24.71 U3.27 23.62,26.46 23.62,28.75 v22.76,29.61 | R11.1 11.75,28.7 v11.8,28.15
  Bottom 0.254: v23.36,24.64 14.73,24.64 14.22,24.13 v8.89,24.13 11.8,27.04 v11.8,28.15 | JP4.2 19.3,48.77 21.84,46.23 21.84,35.56 21.08,34.8 21.1,34.8 21.1,34.25 22.9,32.45 22.9,31.71 22.65,31.45 22.65,29.72 v22.76,29.61
SS  (via drill 0.6)
  Top 0.254: U3.14 23.55,14.04 27.43,10.16 27.45,10.15 27.45,8.4 27.95,7.9 27.95,5.62 v27.98,5.59 | v33.02,5.59 33.78,5.59 34.29,5.08 JP1.4 | U$1.3 36.89,28.66 36.2,29.35 34.6,29.35 30.9,25.65 v30.9,22.05
  Bottom 0.254: v33.02,5.59 v27.98,5.59 27.95,5.55 26.4,5.55 25.7,6.25 25.7,10.85 26.22,11.37 26.22,11.47 29,14.25 29,15.05 28,16.05 28,21.25 28.8,22.05 v30.9,22.05
TXD
  Top 0.254: U3.30 21.08,26.42 21.08,27.69 19.81,28.96 19.81,35.07 21.16,36.41 U5.1
V+  (via drill 0.6)
  Top 0.254: U4.3 47.27,40.28 U2.3 47.22,40.39 49.78,40.39 50.55,41.15 50.55,47.37 JP2.1 | v40.64,47.24 39.37,48.51 38.86,48.51 C10.1
  Bottom 0.254: v40.64,47.24 51.82,47.24 JP2.1

### Text on the board
tPlace: - | +
tNames: Analog 1 | 3.3V | GND | SDA | SCL | RSSIO | Analog 2 | Analog 3 | TX | RX | Charging | D9 PWM | D6 PWM | D5 PWM | SCK | MISO | MOSI | D8 | D7 | D4 | CS
bNames: MRF49XA v1- Test board / imagiro designs
_tsilk: LM317 | GND | R1 | R2 | RSSIO | .01uF | Fence | 2.2uF | 2.2nF | 220pF | !CS | 2.2nF | 10nF | SDO | IRO | 33nH | 5.1pF | MRF49XA | 47nH | 2.2nF | 390nH | RCO | 2.7pF | 68pF | 10Mhz
_bsilk: V+ | SDI | DATA | CLKOUT | !RESET | TAPR Open Hardware License | Licensed under the | (C) 2010 - William Dillon KD7VMY | Philomath Oregon | Custom Radio Devices | MRF49XA Breakout Board Rev. 1 | 3.3v